# EAGLE design Regulated Power Supply (EAGLE 7.2.0)
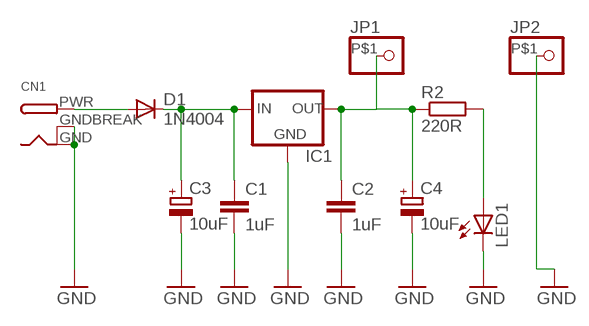
[diagram p0: schematic, sheet 1]

## Parts
C1  1uF  C-EU025-025X050  [C025-025X050]
C2  1uF  C-EU025-025X050  [C025-025X050]
C3  10uF  CPOL-EUE1.8-4  [E1,8-4]
C4  10uF  CPOL-EUE1.8-4  [E1,8-4]
CN1  DCBARRELPTH  [DCJACK_2MM_PTH]
D1  1N4004  [DO41-10]
IC1  78XXL  [78XXL]
JP1  PINHD-1X1-BIGPOGO  [1X1-BIGPOGO]
JP2  PINHD-1X1-BIGPOGO  [1X1-BIGPOGO]
LED1  LED5MM  [LED5MM]
R2  220R  R-EU_0309/V  [0309V]

## Nets
GND: C1.2 C2.2 C3.- C4.- CN1.GND CN1.GNDBREAK IC1.GND JP2.P$1 LED1.K(C)
N$1: CN1.PWR D1.A
N$2: C1.1 C3.+ D1.C IC1.IN
N$3: C2.1 C4.+ IC1.OUT JP1.P$1 R2.1
N$4: LED1.A R2.2

## Library data of the parts
C1 C2 = CommonParts:C-EU: CAPACITOR, European symbol
C3 C4 = CommonParts:CPOL-EU: POLARIZED CAPACITOR, European symbol
CN1 = CommonParts:DCBARREL: 2.0mm DC Barrel Jack DCJACK_2MM_PTH - Through Hole Jack (4UConnector: 05537)
D1 = CommonParts:1N4004: DIODE general purpose rectifier, 1 A
IC1 = CommonParts:78XXL: VOLTAGE REGULATOR
JP1 JP2 = adafruit:PINHD-1X1: Pin header 1x1 for 0.1" spacing With round pins
LED1 = CommonParts:LED: LED OSRAM: - CHIPLED LG R971, LG N971, LY N971, LG Q971, LY Q971, LO R971, LY R971 LH N974, LH R974 LS Q976, LO Q976, LY Q976 LO Q996 - Hyper CHIPLED LW Q18S LB Q993, LB Q99A, LB R99A - SideLED LS A670, LO A670, LY A670, LG A670, LP A670 LB A673, LV A673, LT A673, LW A673 LH A674 LY A675 LS A676, LA A676, LO A676, LY A676, LW A676 LS A679, LY A679, LG A679 - Hyper Micro SIDELED® LS Y876, LA Y876, LO Y876, LY Y876 LT Y87S - SmartLED LW L88C, LW L88S LB L89C, LB L89S, LG L890 LS L89K, LO L89K, LY L89K LS L896, LA L896, LO L896, LY L896 - TOPLED LS T670, LO T670, LY T670, LG T670, LP T670 LSG T670, LSP T670, LSY T670, LOP T670, LYG T670 LG T671, LOG T671, LSG T671 LB T673, LV T673, LT T673, LW T673 LH T674 LS T676, LA T676, LO T676, LY T676, LB T676, LH T676, LSB T676, LW T676 LB T67C, LV T67C, LT T67C, LS T67K, LO T67K, LY T67K, LW E67C LS E67B, LA E67B, LO E67B, LY E67B, LB E67C, LV E67C, LT E67C LW T67C LS T679, LY T679, LG T679 LS T770, LO T770, LY T770, LG T770, LP T770 LB T773, LV T773, LT T773, LW T773 LH T774 LS E675, LA E675, LY E675, LS T675 LS T776, LA T776, LO T776, LY T776, LB T776 LHGB T686 LT T68C, LB T68C - Hyper Mini TOPLED® LB M676 - Mini TOPLED Santana® LG M470 LS M47K, LO M47K, LY M47K Source: http://www.osram.convergy.de LUXEON: - LUMILED® LXK2-PW12-R00, LXK2-PW12-S00, LXK2-PW14-U00, LXK2-PW14-V00 LXK2-PM12-R00, LXK2-PM12-S00, LXK2-PM14-U00 LXK2-PE12-Q00, LXK2-PE12-R00, LXK2-PE12-S00, LXK2-PE14-T00, LXK2-PE14-U00 LXK2-PB12-K00, LXK2-PB12-L00, LXK2-PB12-M00, LXK2-PB14-N00, LXK2-PB14-P00, LXK2-PB14-Q00 LXK2-PR12-L00, LXK2-PR12-M00, LXK2-PR14-Q00, LXK2-PR14-R00 LXK2-PD12-Q00, LXK2-PD12-R00, LXK2-PD12-S00 LXK2-PH12-R00, LXK2-PH12-S00 LXK2-PL12-P00, LXK2-PL12-Q00, LXK2-PL12-R00 Source: www.luxeon.com KINGBRIGHT: KA-3528ASYC Source: www.kingbright.com
R2 = CommonParts:R-EU_: RESISTOR, European symbol

## Board
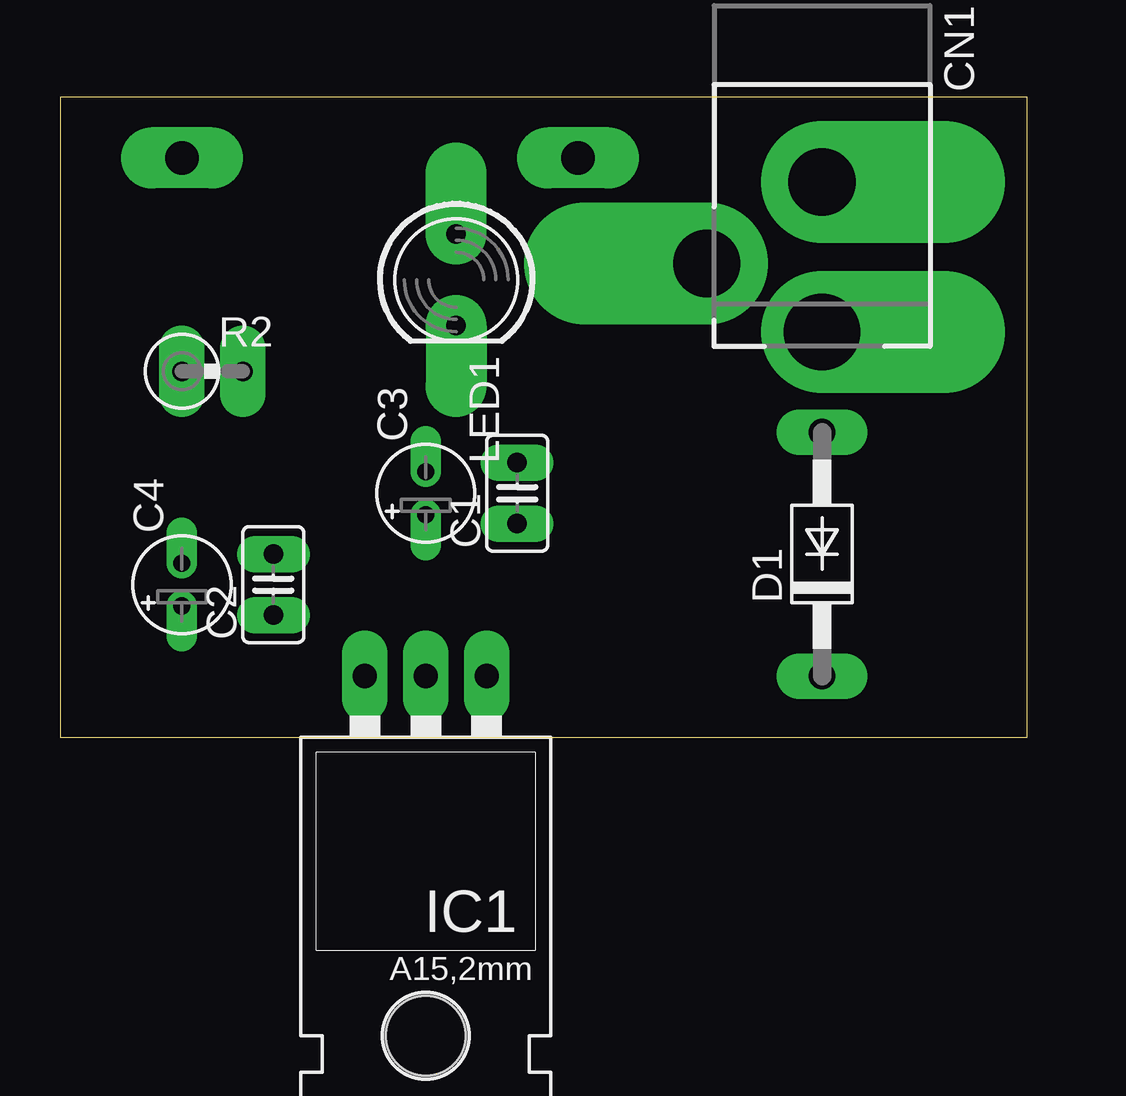
[diagram p1: board, top side]
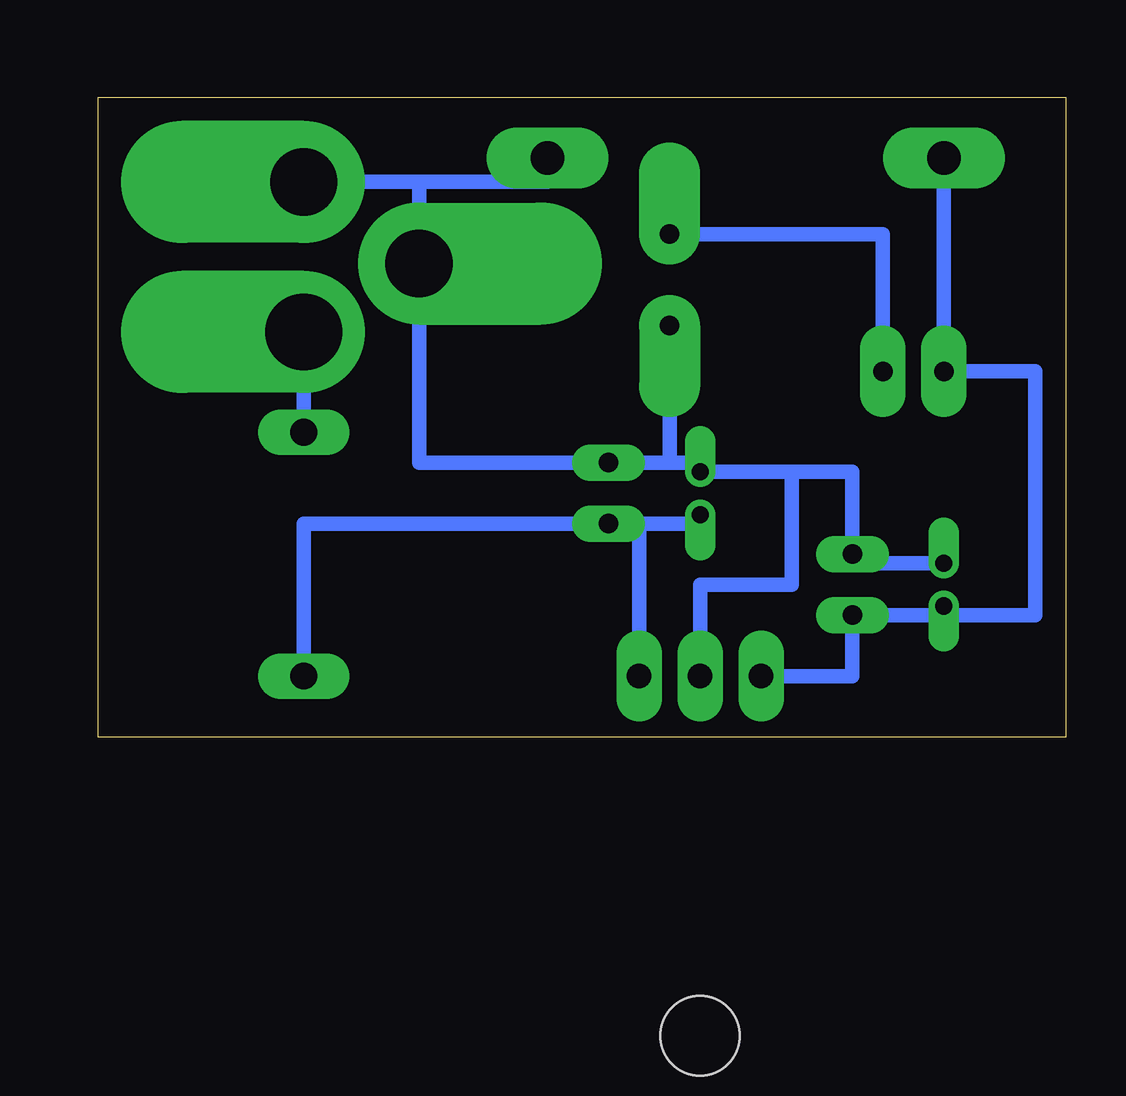
[diagram p2: board, bottom side, seen from below]

Size 40.31 x 26.66 mm. Coordinates in mm from the lower left corner, seen from the top.
Outline: 0,0 40.31,0 40.31,26.66 0,26.66 0,0
Copper layers (1*16): Top 0.035mm / dielectric 1.5mm / Bottom 0.035mm
Design rules "default": minimum track width 40mil, minimum drill 24mil, track to track 40mil, track to pad 40mil, pad to pad 40mil, via to via 40mil, smd to smd 8mil, copper to edge 40mil, drill to drill 8mil, minimum pad ring 10mil, minimum via ring 8mil, stop-mask expansion 4mil, vias tented up to drill 0mil, thermal gap 10mil

### Footprints (pad centres in the part's own frame; a part is rotated, then mirrored left to right if it is on the bottom)
C025-025X050 = drill 0.813 pad 1.524 long: 1 -1.27,0; 2 1.27,0
E1,8-4 = drill 0.711 pad 1.27 offset: + -0.889,0; - 0.889,0
DCJACK_2MM_PTH = drill 2.8 pad 5.08 offset: GND 0,7.35; GNDBREAK 4.8,10.75 | drill 3.2 pad 5.08 offset: PWR 0,13.6
DO41-10 = drill 1.118 pad 1.905 long: A 5.08,0; C -5.08,0
78XXL = drill 1.016 pad 1.905 long: GND 0,-3.81; IN -2.54,-3.81; OUT 2.54,-3.81 | hole 3.302: 0,11.176
1X1-BIGPOGO = drill 1.4 pad 2.54 long: P$1 0,0
LED5MM = drill 0.813 pad 2.54 offset: A -1.905,0; K 1.905,0
0309V = drill 0.813 pad 1.905 long: 1 -1.27,0; 2 1.27,0

### Placement (x,y rotation side)
C1  19.05,10.16 90 top
C2  8.89,6.35 90 top
C3  15.24,10.16 90 top
C4  5.08,6.35 90 top
CN1  31.75,30.48 180 top
D1  31.75,7.62 90 top
IC1  15.24,-1.27 180 top
JP1  5.08,24.13 180 top
JP2  21.59,24.13 180 top
LED1  16.51,19.05 270 top
R2  6.35,15.24 0 top

### Tracks (layer width: path | path; a pad name or v marks a point on that pad's centre or on a via)
GND
  Bottom 0.61: 11.43,11.05 8.89,11.05 C2.2 8.89,7.24 C4.- | IC1.GND 15.24,6.35 11.43,6.35 11.43,11.05 | 11.43,11.05 C3.- 15.24,11.43 16.51,11.43 | 16.51,11.43 C1.2 26.95,11.43 CN1.GNDBREAK 26.95,23.13 CN1.GND 21.59,23.13 JP2.P$1 | LED1.K 16.51,11.43
N$1
  Bottom 0.61: CN1.PWR D1.A
N$2
  Bottom 0.61: C1.1 15.24,8.89 C3.+ | C1.1 17.78,8.89 IC1.IN | C1.1 31.75,8.89 D1.C
N$3
  Bottom 0.61: IC1.OUT 8.89,2.54 C2.1 5.08,5.08 | 5.08,5.08 1.27,5.08 1.27,15.24 R2.1 JP1.P$1 | 5.08,5.08 C4.+
N$4
  Bottom 0.61: LED1.A 7.62,20.95 R2.2